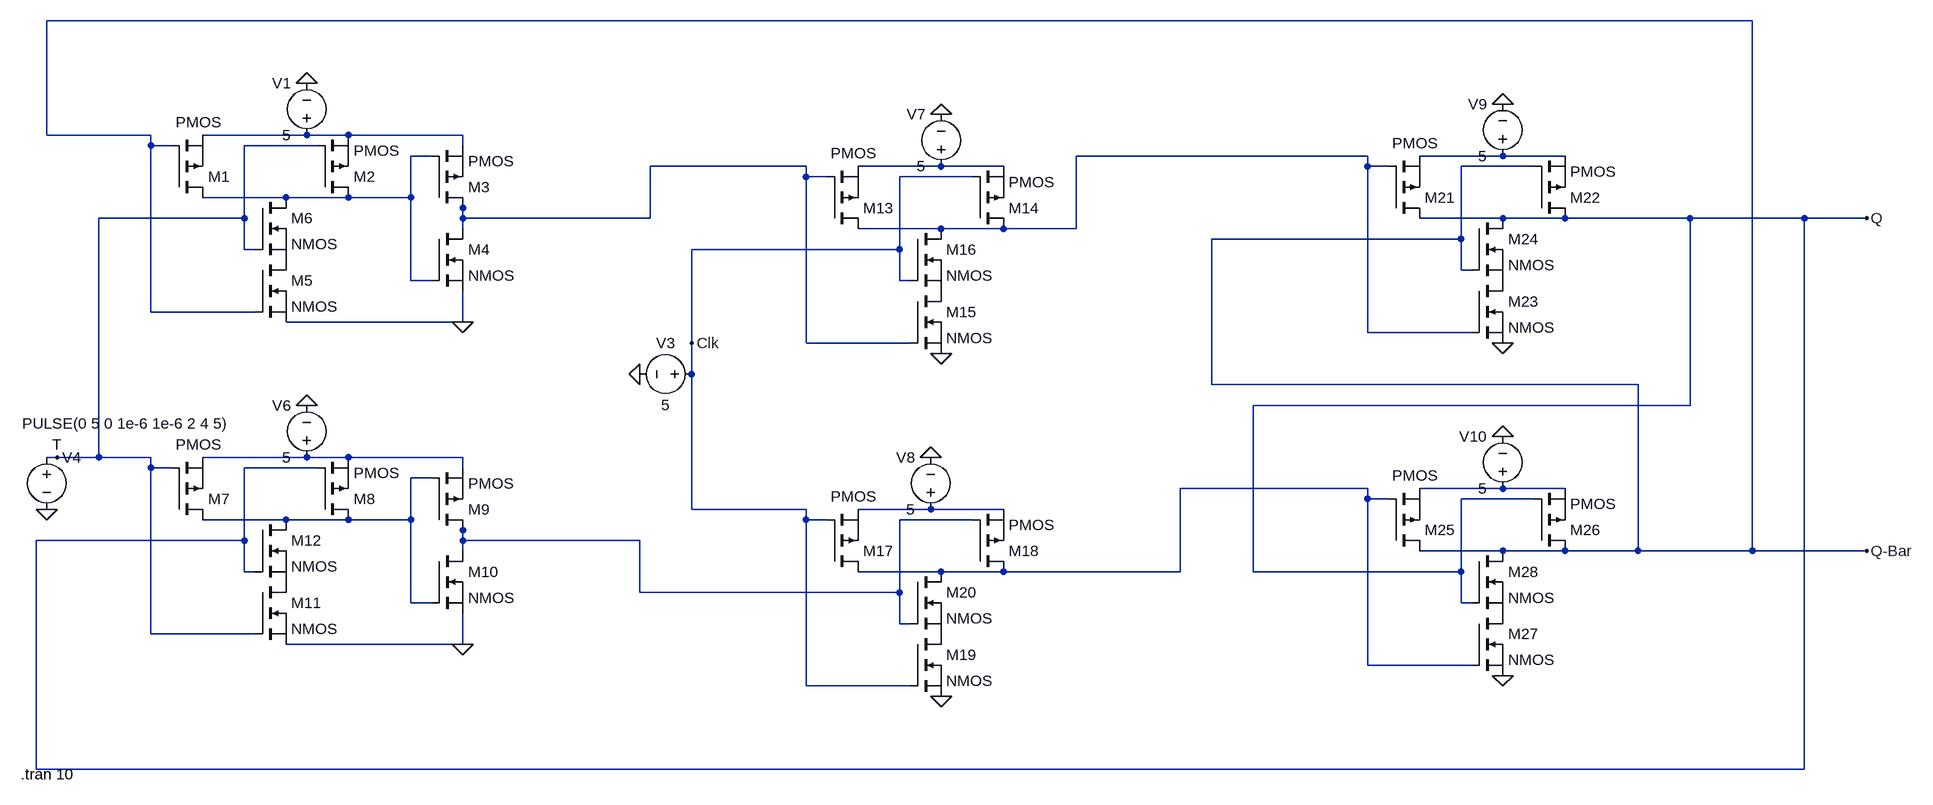
[diagram p0: schematic T-Flipflop.asc]
T-Flipflop.asc, the LTspice schematic file:
Version 4
SHEET 1 2572 920
WIRE 2288 -256 -336 -256
WIRE -336 -80 -336 -256
WIRE -176 -80 -336 -80
WIRE 64 -80 -96 -80
WIRE 128 -80 64 -80
WIRE 304 -80 128 -80
WIRE -176 -64 -176 -80
WIRE -144 -64 -176 -64
WIRE 80 -64 -32 -64
WIRE 304 -64 304 -80
WIRE 256 -48 224 -48
WIRE 1696 -48 1248 -48
WIRE 1904 -48 1776 -48
WIRE 2000 -48 1904 -48
WIRE 832 -32 592 -32
WIRE 1040 -32 912 -32
WIRE 1136 -32 1040 -32
WIRE 1696 -32 1696 -48
WIRE 1728 -32 1696 -32
WIRE 1952 -32 1840 -32
WIRE 832 -16 832 -32
WIRE 864 -16 832 -16
WIRE 1088 -16 976 -16
WIRE 32 16 -96 16
WIRE 128 16 32 16
WIRE 224 16 224 -48
WIRE 224 16 128 16
WIRE 304 32 304 16
WIRE -32 48 -32 -64
WIRE -32 48 -256 48
WIRE 304 48 304 32
WIRE 592 48 592 -32
WIRE 592 48 304 48
WIRE 1904 48 1776 48
WIRE 2000 48 1904 48
WIRE 2192 48 2000 48
WIRE 2368 48 2192 48
WIRE 2464 48 2368 48
WIRE 304 64 304 48
WIRE 1040 64 912 64
WIRE 1136 64 1040 64
WIRE 1248 64 1248 -48
WIRE 1248 64 1136 64
WIRE 1840 80 1840 -32
WIRE 1840 80 1456 80
WIRE -32 96 -32 48
WIRE -16 96 -32 96
WIRE 976 96 976 -16
WIRE 976 96 656 96
WIRE 1840 128 1840 80
WIRE 1856 128 1840 128
WIRE 224 144 224 16
WIRE 256 144 224 144
WIRE 976 144 976 96
WIRE 992 144 976 144
WIRE -176 192 -176 -64
WIRE -16 192 -176 192
WIRE 304 208 304 160
WIRE 304 208 32 208
WIRE 1696 224 1696 -32
WIRE 1856 224 1696 224
WIRE 656 240 656 96
WIRE 832 240 832 -16
WIRE 992 240 832 240
WIRE 656 288 656 240
WIRE 1456 304 1456 80
WIRE 2112 304 1456 304
WIRE 2192 336 2192 48
WIRE 2192 336 1520 336
WIRE -320 416 -336 416
WIRE -256 416 -256 48
WIRE -256 416 -320 416
WIRE -176 416 -256 416
WIRE 64 416 -96 416
WIRE 128 416 64 416
WIRE 304 416 128 416
WIRE -176 432 -176 416
WIRE -144 432 -176 432
WIRE 80 432 -32 432
WIRE 304 432 304 416
WIRE 256 448 224 448
WIRE 1696 464 1408 464
WIRE 1904 464 1776 464
WIRE 2000 464 1904 464
WIRE 1696 480 1696 464
WIRE 1728 480 1696 480
WIRE 1952 480 1840 480
WIRE 656 496 656 288
WIRE 832 496 656 496
WIRE 1024 496 912 496
WIRE 1136 496 1024 496
WIRE 32 512 -96 512
WIRE 128 512 32 512
WIRE 224 512 224 448
WIRE 224 512 128 512
WIRE 832 512 832 496
WIRE 864 512 832 512
WIRE 1088 512 976 512
WIRE 304 528 304 512
WIRE -32 544 -32 432
WIRE -32 544 -352 544
WIRE 304 544 304 528
WIRE 576 544 304 544
WIRE 304 560 304 544
WIRE 1904 560 1776 560
WIRE 2000 560 1904 560
WIRE 2112 560 2112 304
WIRE 2112 560 2000 560
WIRE 2288 560 2288 -256
WIRE 2288 560 2112 560
WIRE 2464 560 2288 560
WIRE -32 592 -32 544
WIRE -16 592 -32 592
WIRE 1040 592 912 592
WIRE 1136 592 1040 592
WIRE 1408 592 1408 464
WIRE 1408 592 1136 592
WIRE 1520 592 1520 336
WIRE 1840 592 1840 480
WIRE 1840 592 1520 592
WIRE 576 624 576 544
WIRE 976 624 976 512
WIRE 976 624 576 624
WIRE 224 640 224 512
WIRE 256 640 224 640
WIRE 1840 640 1840 592
WIRE 1856 640 1840 640
WIRE 976 672 976 624
WIRE 992 672 976 672
WIRE -176 688 -176 432
WIRE -16 688 -176 688
WIRE 304 704 304 656
WIRE 304 704 32 704
WIRE 1696 736 1696 480
WIRE 1856 736 1696 736
WIRE 832 768 832 512
WIRE 992 768 832 768
WIRE -352 896 -352 544
WIRE 2368 896 2368 48
WIRE 2368 896 -352 896
FLAG 304 208 0
FLAG 64 -160 0
FLAG -336 496 0
FLAG 304 704 0
FLAG 64 336 0
FLAG 1040 784 0
FLAG 1904 240 0
FLAG 1904 752 0
FLAG 1040 256 0
FLAG 576 288 0
FLAG 1040 -112 0
FLAG 1024 416 0
FLAG 1904 -128 0
FLAG 1904 384 0
FLAG 2464 48 Q
FLAG 2464 560 Q-Bar
FLAG -320 416 T
FLAG 656 240 Clk
SYMBOL pmos -144 16 M180
WINDOW 3 6 116 Left 2
SYMATTR InstName M1
SYMBOL pmos 80 16 M180
SYMATTR InstName M2
SYMBOL pmos 256 32 M180
SYMATTR InstName M3
SYMBOL nmos 256 64 R0
SYMATTR InstName M4
SYMBOL nmos -16 112 R0
SYMATTR InstName M5
SYMBOL nmos -16 16 R0
SYMATTR InstName M6
SYMBOL voltage 64 -64 R180
WINDOW 0 24 96 Left 2
WINDOW 3 24 16 Left 2
WINDOW 123 0 0 Left 2
WINDOW 39 0 0 Left 2
SYMATTR InstName V1
SYMATTR Value 5
SYMBOL pmos -144 512 M180
WINDOW 3 6 116 Left 2
SYMATTR InstName M7
SYMBOL pmos 80 512 M180
SYMATTR InstName M8
SYMBOL pmos 256 528 M180
SYMATTR InstName M9
SYMBOL nmos 256 560 R0
SYMATTR InstName M10
SYMBOL nmos -16 608 R0
SYMATTR InstName M11
SYMBOL nmos -16 512 R0
SYMATTR InstName M12
SYMBOL voltage -336 400 R0
WINDOW 123 0 0 Left 2
WINDOW 39 0 0 Left 2
WINDOW 3 -38 -36 Left 2
SYMATTR Value PULSE(0 5 0 1e-6 1e-6 2 4 5)
SYMATTR InstName V4
SYMBOL voltage 64 432 R180
WINDOW 0 24 96 Left 2
WINDOW 3 24 16 Left 2
WINDOW 123 0 0 Left 2
WINDOW 39 0 0 Left 2
SYMATTR InstName V6
SYMATTR Value 5
SYMBOL pmos 864 592 M180
WINDOW 3 6 116 Left 2
SYMATTR InstName M17
SYMBOL pmos 1088 592 M180
SYMATTR InstName M18
SYMBOL nmos 992 688 R0
SYMATTR InstName M19
SYMBOL nmos 992 592 R0
SYMATTR InstName M20
SYMBOL pmos 1728 48 M180
WINDOW 3 6 116 Left 2
SYMATTR InstName M21
SYMBOL pmos 1952 48 M180
SYMATTR InstName M22
SYMBOL nmos 1856 144 R0
SYMATTR InstName M23
SYMBOL nmos 1856 48 R0
SYMATTR InstName M24
SYMBOL pmos 1728 560 M180
WINDOW 3 6 116 Left 2
SYMATTR InstName M25
SYMBOL pmos 1952 560 M180
SYMATTR InstName M26
SYMBOL nmos 1856 656 R0
SYMATTR InstName M27
SYMBOL nmos 1856 560 R0
SYMATTR InstName M28
SYMBOL pmos 864 64 M180
WINDOW 3 6 116 Left 2
SYMATTR InstName M13
SYMBOL pmos 1088 64 M180
SYMATTR InstName M14
SYMBOL nmos 992 160 R0
SYMATTR InstName M15
SYMBOL nmos 992 64 R0
SYMATTR InstName M16
SYMBOL voltage 672 288 R90
WINDOW 0 -32 56 VBottom 2
WINDOW 3 32 56 VTop 2
WINDOW 123 0 0 Left 2
WINDOW 39 0 0 Left 2
SYMATTR InstName V3
SYMATTR Value 5
SYMBOL voltage 1040 -16 R180
WINDOW 0 24 96 Left 2
WINDOW 3 24 16 Left 2
WINDOW 123 0 0 Left 2
WINDOW 39 0 0 Left 2
SYMATTR InstName V7
SYMATTR Value 5
SYMBOL voltage 1024 512 R180
WINDOW 0 24 96 Left 2
WINDOW 3 24 16 Left 2
WINDOW 123 0 0 Left 2
WINDOW 39 0 0 Left 2
SYMATTR InstName V8
SYMATTR Value 5
SYMBOL voltage 1904 -32 R180
WINDOW 0 24 96 Left 2
WINDOW 3 24 16 Left 2
WINDOW 123 0 0 Left 2
WINDOW 39 0 0 Left 2
SYMATTR InstName V9
SYMATTR Value 5
SYMBOL voltage 1904 480 R180
WINDOW 0 24 96 Left 2
WINDOW 3 24 16 Left 2
WINDOW 123 0 0 Left 2
WINDOW 39 0 0 Left 2
SYMATTR InstName V10
SYMATTR Value 5
TEXT -376 904 Left 2 !.tran 10

The netlist it stands for:
* T-Flipflop.asc
M1 N002 Q-Bar N001 N001 PMOS
M2 N002 T N001 N001 PMOS
M3 N005 N002 N001 N001 PMOS
M4 N005 N002 0 0 NMOS
M5 P001 Q-Bar 0 0 NMOS
M6 N002 T P001 P001 NMOS
V1 N001 0 5
M7 N008 T N007 N007 PMOS
M8 N008 Q N007 N007 PMOS
M9 N012 N008 N007 N007 PMOS
M10 N012 N008 0 0 NMOS
M11 P002 T 0 0 NMOS
M12 N008 Q P002 P002 NMOS
V4 T 0 PULSE(0 5 0 1e-6 1e-6 2 4 5)
V6 N007 0 5
M17 N009 Clk N011 N011 PMOS
M18 N009 N012 N011 N011 PMOS
M19 P003 Clk 0 0 NMOS
M20 N009 N012 P003 P003 NMOS
M21 Q N003 N004 N004 PMOS
M22 Q Q-Bar N004 N004 PMOS
M23 P004 N003 0 0 NMOS
M24 Q Q-Bar P004 P004 NMOS
M25 Q-Bar N009 N010 N010 PMOS
M26 Q-Bar Q N010 N010 PMOS
M27 P005 N009 0 0 NMOS
M28 Q-Bar Q P005 P005 NMOS
M13 N003 N005 N006 N006 PMOS
M14 N003 Clk N006 N006 PMOS
M15 P006 N005 0 0 NMOS
M16 N003 Clk P006 P006 NMOS
V3 Clk 0 5
V7 N006 0 5
V8 N011 0 5
V9 N004 0 5
V10 N010 0 5
.model NMOS NMOS
.model PMOS PMOS
.lib standard.mos
.tran 10
.backanno
.end